# EAGLE design giraffe_clarity (EAGLE 9.2.1)
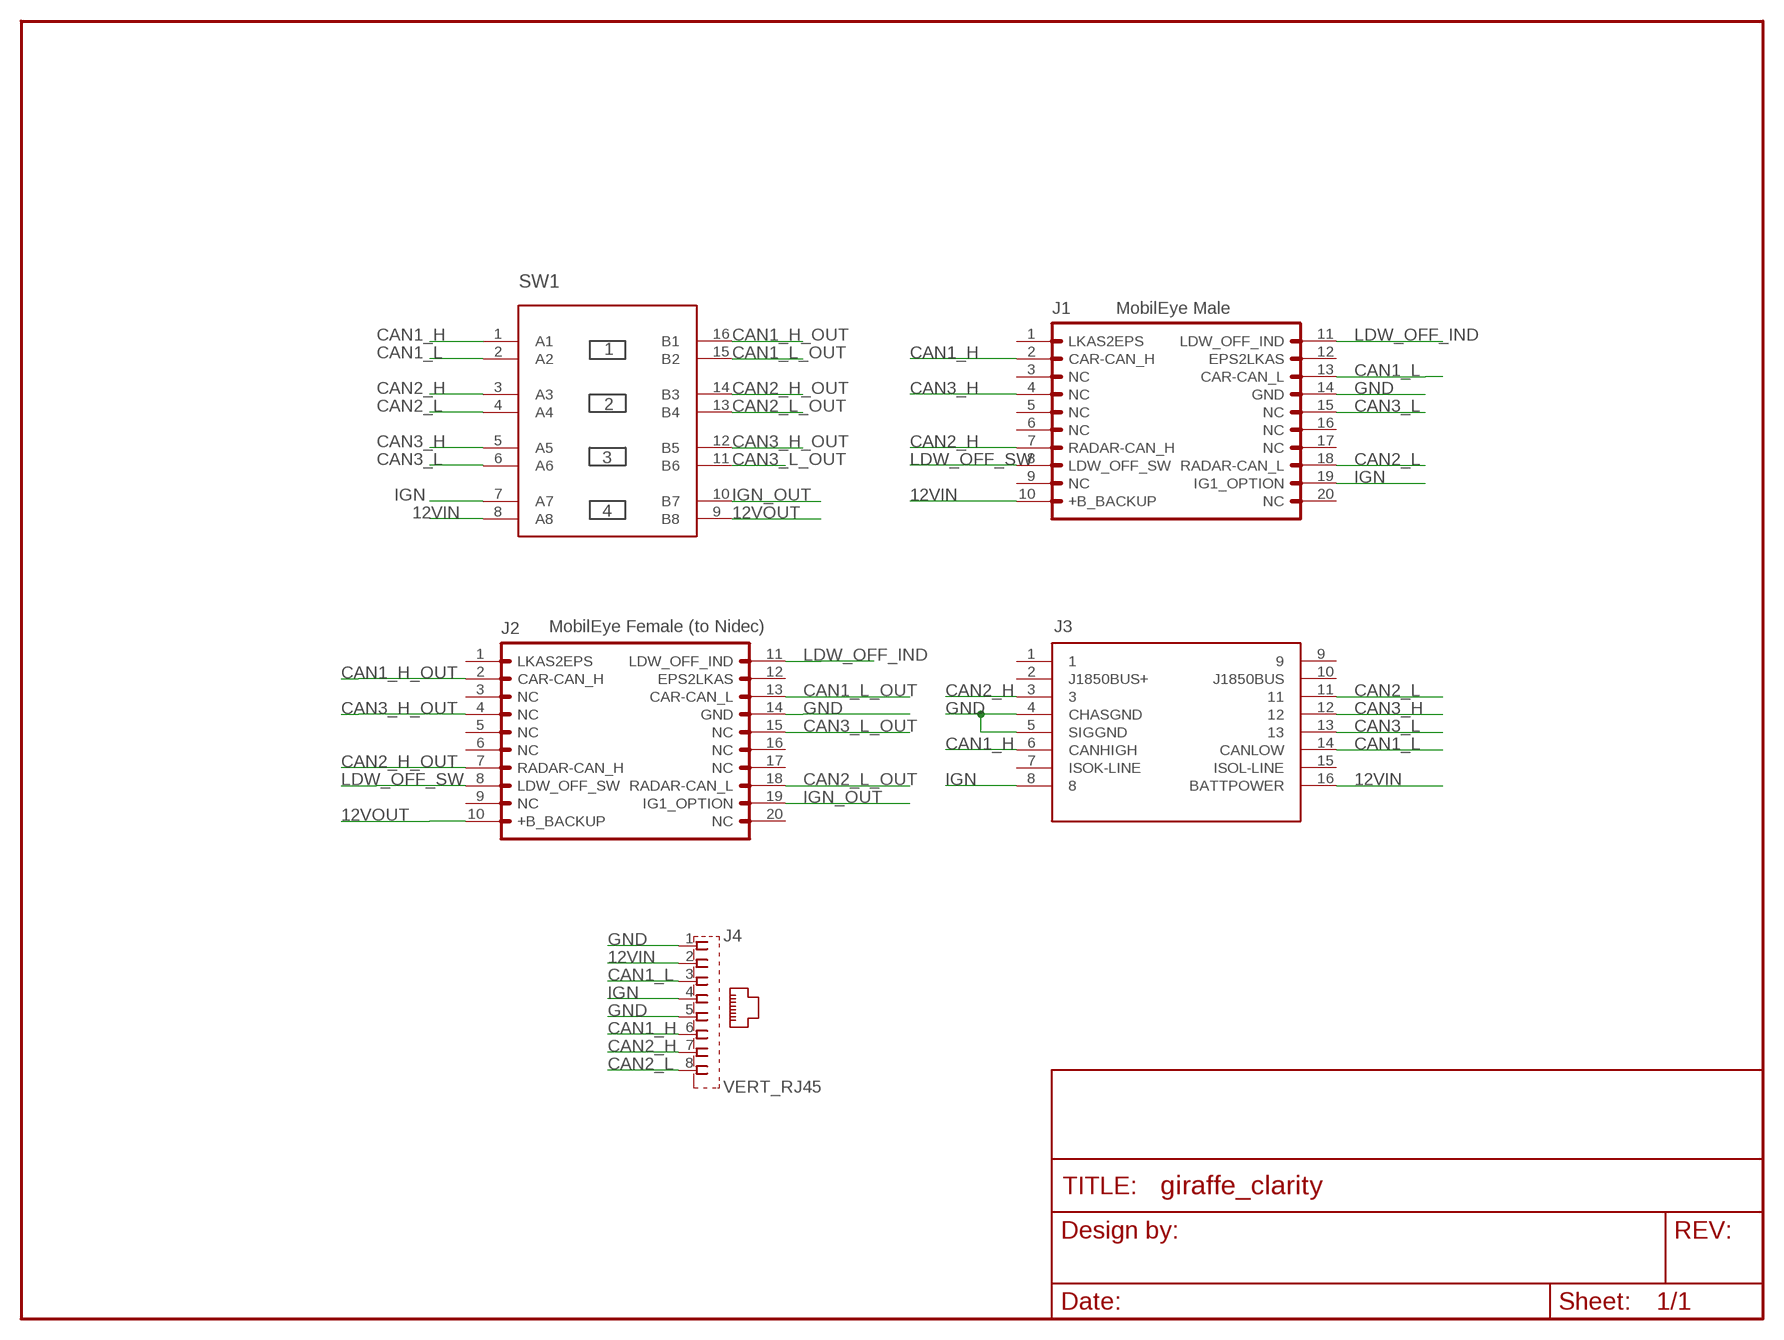
[diagram p0: schematic, sheet 1]

## Parts
FRAME1  FRAME-LETTERNO_PACKAGE  [DUMMY]
J1  MOBILEYERAMALE  [2X10(RA)]
J2  MOBILEYEFEMALE  [2X10(JAE_FEMALE)]
J3  OBDII-FEMALE-CUT  [OBDII-FEMALE-MIDCUT]
J4  VERT_RJ45  [GLX-S-88M]
SW1  4XDPSTSMT  [4-DPST]

## Nets
12VIN: J1.10(+B_BACKUP) J3.16(BATTPOWER) J4.2 SW1.8(A8)
12VOUT: J2.10(+B_BACKUP) SW1.9(B8)
CAN1_H: J1.2(CAR-CAN_H) J3.6(CANHIGH) J4.6 SW1.1(A1)
CAN1_H_OUT: J2.2(CAR-CAN_H) SW1.16(B1)
CAN1_L: J1.13(CAR-CAN_L) J3.14(CANLOW) J4.3 SW1.2(A2)
CAN1_L_OUT: J2.13(CAR-CAN_L) SW1.15(B2)
CAN2_H: J1.7(RADAR-CAN_H) J3.3 J4.7 SW1.3(A3)
CAN2_H_OUT: J2.7(RADAR-CAN_H) SW1.14(B3)
CAN2_L: J1.18(RADAR-CAN_L) J3.11 J4.8 SW1.4(A4)
CAN2_L_OUT: J2.18(RADAR-CAN_L) SW1.13(B4)
CAN3_H: J1.4(NC) J3.12 SW1.5(A5)
CAN3_H_OUT: J2.4(NC) SW1.12(B5)
CAN3_L: J1.15(NC) J3.13 SW1.6(A6)
CAN3_L_OUT: J2.15(NC) SW1.11(B6)
GND: J1.14(GND) J2.14(GND) J3.4(CHASGND) J3.5(SIGGND) J4.1 J4.5
IGN: J1.19(IG1_OPTION) J3.8 J4.4 SW1.7(A7)
IGN_OUT: J2.19(IG1_OPTION) SW1.10(B7)
LDW_OFF_IND: J1.11(LDW_OFF_IND) J2.11(LDW_OFF_IND)
LDW_OFF_SW: J1.8(LDW_OFF_SW) J2.8(LDW_OFF_SW)
Unconnected: J1.1(LKAS2EPS) J1.3(NC) J1.5(NC) J1.6(NC) J1.9(NC) J1.12(EPS2LKAS) J1.16(NC) J1.17(NC) J1.20(NC) J2.1(LKAS2EPS) J2.3(NC) J2.5(NC) J2.6(NC) J2.9(NC) J2.12(EPS2LKAS) J2.16(NC) J2.17(NC) J2.20(NC) J3.1 J3.2(J1850BUS+) J3.7(ISOK-LINE) J3.9 J3.10(J1850BUS) J3.15(ISOL-LINE)

## Notes on the sheet
- MobilEye Male
- MobilEye Female (to Nidec)

## Library data of the parts
FRAME1 = SparkFun-Aesthetics:FRAME-LETTER: Schematic Frame Standard 8.5x11 US Letter frame; DESIGNER: Nobody; VERSION: v01
J1 J2 = comma.ai:MOBILEYE: MobileEye connector for Acura ILX
J3 = comma.ai:OBDII-FEMALE
J4 = comma.ai:VERT_RJ45: Mod. Jack, Right Angle, 8 posiotion, 8 contatcs RJ45 Source: GLX-S-88M.pdf; OC_FARNELL: unknown; OC_NEWARK: unknown
SW1 = comma.ai:4XDPST

## Net classes
1 data: width 0.254 mm, clearance 0.254 mm

## Board
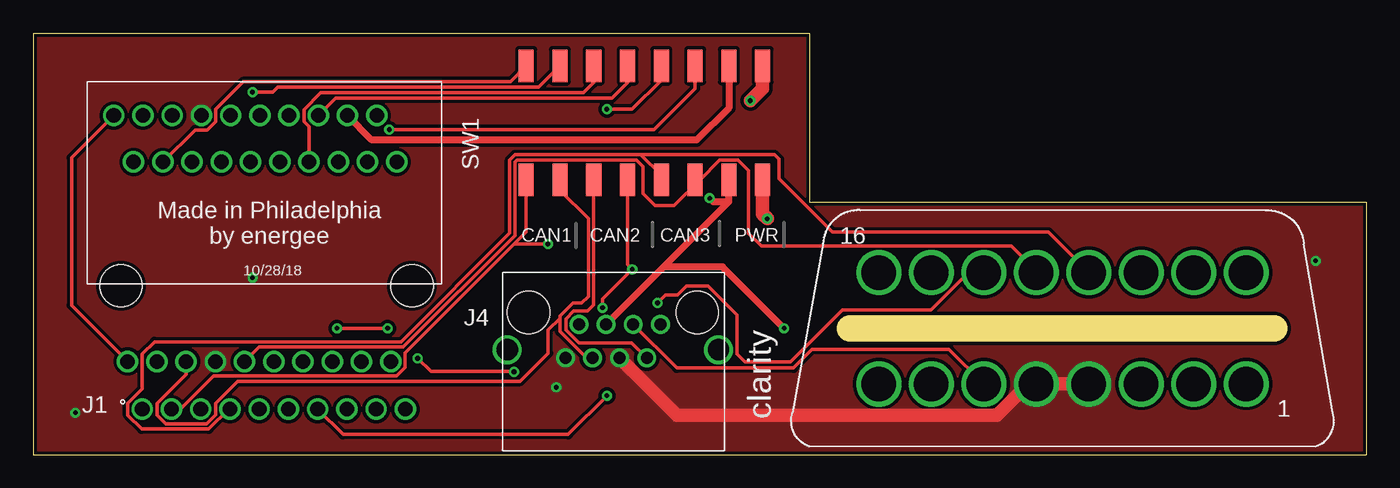
[diagram p1: board, top side]
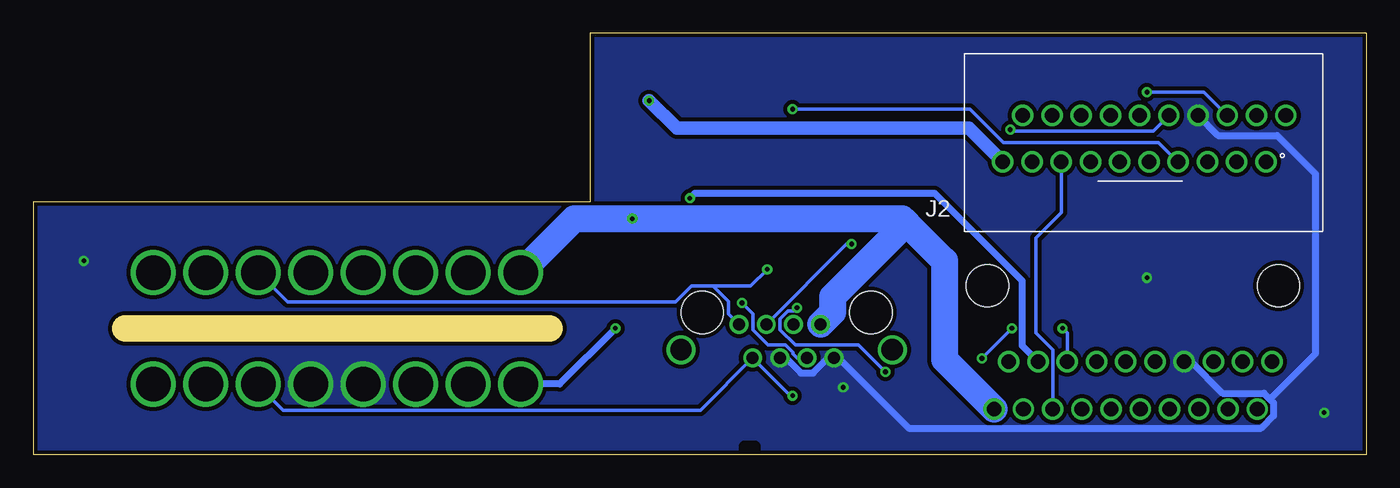
[diagram p2: board, bottom side, seen from below]

Size 100.33 x 31.75 mm. Coordinates in mm from the lower left corner, seen from the top.
Outline: 61.47,9.53 93.4,9.53
Outline: 0,31.75 58.42,31.75 58.42,19.05 100.33,19.05 100.33,0 0,0 0,31.75
Copper layers (1*16): Top 0.035mm / dielectric 1.5mm / Bottom 0.035mm
Design rules "default *": minimum track width 6mil, minimum drill 10mil, track to track 6mil, track to pad 6mil, pad to pad 6mil, via to via 6mil, smd to smd 6mil, copper to edge 10mil, drill to drill 10mil, minimum pad ring 10mil, minimum via ring 8mil, stop-mask expansion 4mil, vias tented up to drill 100mil, thermal gap 10mil
bRestrict: area 46,0.2 to 46.8,0.6

### Footprints (pad centres in the part's own frame; a part is rotated, then mirrored left to right if it is on the bottom)
2X10(RA) = drill 1.1 pad 1.422: 1 9.83,1.83; 2 7.63,1.83; 3 5.43,1.83; 4 3.23,1.83; 5 1.03,1.83; 6 -1.17,1.83; 7 -3.37,1.83; 8 -5.57,1.83; 9 -7.77,1.83; 10 -9.97,1.83; 11 10.93,-1.77; 12 8.73,-1.77; 13 6.53,-1.77; 14 4.33,-1.77; 15 2.13,-1.77; 16 -0.07,-1.77; 17 -2.27,-1.77; 18 -4.47,-1.77; 19 -6.67,-1.77; 20 -8.87,-1.77 | hole 3.2: -10.47,-7.47; 11.43,-7.47
2X10(JAE_FEMALE) = drill 1.1 pad 1.422: 1 -8.7,1.75; 2 -6.5,1.75; 3 -4.3,1.75; 4 -2.1,1.75; 5 0.1,1.75; 6 2.3,1.75; 7 4.5,1.75; 8 6.7,1.75; 9 8.9,1.75; 10 11.1,1.75; 11 -10.2,-1.75; 12 -8,-1.75; 13 -5.8,-1.75; 14 -3.6,-1.75; 15 -1.4,-1.75; 16 0.8,-1.75; 17 3,-1.75; 18 5.2,-1.75; 19 7.4,-1.75; 20 9.6,-1.75
OBDII-FEMALE-MIDCUT = drill 2.6 pad 3.4: 1 13.825,-4.2; 2 9.875,-4.2; 3 5.925,-4.2; 4 1.975,-4.2; 5 -1.975,-4.2; 6 -5.925,-4.2; 7 -9.875,-4.2; 8 -13.825,-4.2; 9 13.825,4.2; 10 9.875,4.2; 11 5.925,4.2; 12 1.975,4.2; 13 -1.975,4.2; 14 -5.925,4.2; 15 -9.875,4.2; 16 -13.825,4.2
GLX-S-88M = drill 0.9 pad 1.422: 1 -3.66,1.57; 2 -2.64,4.11; 3 -1.62,1.57; 4 -0.6,4.11; 5 0.42,1.57; 6 1.44,4.11; 7 2.46,1.57; 8 3.48,4.11 | drill 1.6 pad 2.184: S1 -8.04,2.2; S2 7.86,2.2 | hole 3.2: -6.44,5; 6.26,5
4-DPST = smd 1.13 x 2.44: 1 -8.89,-4.3; 2 -6.35,-4.3; 3 -3.81,-4.3; 4 -1.27,-4.3; 5 1.27,-4.3; 6 3.81,-4.3; 7 6.35,-4.3; 8 8.89,-4.3; 9 8.89,4.3; 10 6.35,4.3; 11 3.81,4.3; 12 1.27,4.3; 13 -1.27,4.3; 14 -3.81,4.3; 15 -6.35,4.3; 16 -8.89,4.3

### Placement (x,y rotation side)
FRAME1  -1.27,-12.7 0 top  (outside the outline)
J1  18.03,5.26 180 top
J2  16.26,23.8 180 bottom
J3  77.47,9.53 0 top
J4  43.72,5.71 0 top
SW1  46,24.99 0 top

### Tracks (layer width: path | path; a pad name or v marks a point on that pad's centre or on a via)
12VIN  (via drill 0.35)
  Top 1.016: v55.24,17.78 54.89,18.14 SW1.8
  Bottom 2.032: J3.16 59.59,17.78 v55.24,17.78 34.92,17.78 34.61,17.46 | J1.10 31.75,7.17 31.75,14.61 34.61,17.46 | J4.2 40.15,10.76 40.15,11.92 34.61,17.46
12VOUT  (via drill 0.35)
  Top 1.016: SW1.9 54.89,27.59 v53.98,26.67
  Bottom 1.016: J2.10 29.9,24.59 51.9,24.59 v53.98,26.67
CAN1_H  (via drill 0.35)
  Top 0.254: J3.6 68.93,7.94 58.62,7.94 57.23,6.54 48.44,6.54 J4.6 | SW1.1 37.11,16.79 36.2,15.88 | J1.2 11.07,3.43 13.59,5.94 27.35,5.94 27.99,6.58 27.99,7.67 35.88,15.56 36.2,15.88 | 36.2,15.88 v38.73,15.88
  Bottom 0.254: J4.6 39.11,15.88 v38.73,15.88
CAN1_H_OUT
  Top 0.254: SW1.16 35.91,28.09 15.8,28.09 13.74,26.03 13.74,25.1 13.11,24.47 12.17,24.47 J2.2
CAN1_L  (via drill 0.35)
  Top 0.254: J4.3 41.64,7.29 39.65,9.28 39.65,10.28 | J1.13 11.5,6.06 9.32,3.88 9.32,2.98 9.96,2.34 13.05,2.34 13.72,3.01 13.72,3.88 15.38,5.54 36.65,5.54 38.76,7.64 38.76,9.39 39.65,10.28 | 39.65,10.28 39.65,10.44 40.64,11.43 41.27,11.43 41.78,11.94 41.78,17.78 39.65,19.91 SW1.2 | J3.14 70.39,13.72 67.58,10.9 60.9,10.9 56.98,6.99 53.57,6.99 52.95,7.6 52.95,10.54 50.8,12.7 49.16,12.7 48.51,12.04 47.6,12.04 v46.99,11.43
  Bottom 0.254: J4.3 42.84,7.29 43.15,7.59 43.15,7.7 43.73,8.28 45.01,8.28 46.15,9.41 46.15,10.59 v46.99,11.43
CAN1_L_OUT  (via drill 0.35)
  Top 0.254: SW1.15 38.03,27.68 18.68,27.68 18.67,27.69 18.41,27.69 18.03,27.3 v16.51,27.3
  Bottom 0.254: v16.51,27.3 12.21,27.3 J2.13
CAN2_H  (via drill 0.35)
  Top 0.254: SW1.3 42.19,11.28 41.73,10.82 40.67,10.82 40.09,10.23 40.09,9.41 41.08,8.43 45.04,8.43 J4.7 | J1.7 23.31,1.52 40.26,1.52 v43.18,4.45
  Bottom 0.254: J3.3 83.39,5.21 81.53,3.35 50.12,3.35 J4.7 43.34,4.45 v43.18,4.45
CAN2_H_OUT
  Top 0.254: SW1.14 42.19,28.02 41.44,27.27 21.64,27.27 20.37,26 20.37,25.1 20.76,24.72 J2.7
CAN2_L  (via drill 0.35)
  Top 0.254: v26.67,9.53 v22.86,9.53 | v36.2,6.25 36.18,6.26 29.93,6.26 v28.93,7.26 | SW1.4 44.73,14.32 v45.09,13.97 42.85,11.73 v42.85,11.07
  Bottom 0.254: J3.11 81.19,11.52 51.98,11.52 50.8,12.7 49.16,12.7 | v22.86,9.53 22.5,9.17 J1.18 | v28.93,7.26 v26.67,9.53 | 49.16,12.7 48,11.54 48,10.62 J4.8 | v45.09,13.97 46.36,12.7 49.16,12.7 | v42.85,11.07 43.1,10.82 43.53,10.82 44.11,10.23 44.11,9.41 42.97,8.28 38.22,8.28 v36.2,6.25
CAN2_L_OUT
  Top 0.254: SW1.13 44.73,28.02 43.57,26.86 22.77,26.86 J2.18
CAN3_H
  Top 0.254: J3.12 76.41,16.76 60.17,16.76 56.13,20.8 56.13,22.27 55.8,22.6 45.72,22.6 | J1.4 14.71,3.43 13.22,1.94 8.16,1.94 7.12,2.98 7.12,3.88 8.21,4.97 8.21,7.6 9.12,8.52 27.69,8.52 35.86,16.69 35.86,22.2 36.26,22.6 45.72,22.6 | 45.72,22.6 47.27,21.05 SW1.5
CAN3_H_OUT  (via drill 0.35)
  Top 0.254: SW1.12 47.27,28.22 45.09,26.04 v43.18,26.04
  Bottom 0.254: v43.18,26.04 29.84,26.04 27.3,23.5 15.65,23.5 14.2,22.05 J2.4
CAN3_L
  Top 0.254: J3.13 75.5,13.84 73.64,15.7 54.8,15.7 53.83,16.67 53.83,21.39 53.03,22.19 51.67,22.19 50.17,20.69 50.16,20.69 | SW1.6 50.16,20.69 | J1.15 15.94,7.03 17.02,8.11 27.86,8.11 36.27,16.52 36.27,22.03 36.43,22.19 45.41,22.19 45.89,21.71 45.89,19.68 46.81,18.76 48.23,18.76 50.16,20.69
CAN3_L_OUT  (via drill 0.35)
  Top 0.254: 49.45,29.29 SW1.11 49.81,27.59 46.72,24.49 27.61,24.49 v26.8,24.49
  Bottom 0.254: v26.8,24.49 26.8,24.39 16.02,24.39 J2.15
GND  (via drill 0.35)
  Top 1.016: J4.5 48.46,2.96 72.52,2.96 74.88,5.33 J3.5 J3.4
  Bottom 0.508: J4.5 43.68,7.29 42.56,6.17 41.64,6.17 40.52,7.29 J4.1 39.71,7.29 34.43,2 7.92,2 6.99,2.93 6.99,3.93 7.25,4.18 | 7.25,4.18 7.7,4.64 10.83,4.64 13.22,7.03 J1.14 | 7.25,4.18 3.81,7.62 3.81,21.15 6.71,24.05 11.16,24.05 J2.14
  other vias: 3.17,3.17 16.51,13.34 39.37,5.08 96.52,14.61
  pour Top (isolate 0.254, no thermals): 0,31.75 0,0 100.33,0 100.33,19.05 58.42,19.05 58.42,31.75
  pour Bottom (isolate 0.305, no thermals): -0.05,31.8 58.42,31.8 58.42,19 100.3,19 100.3,0 -0.05,0
IGN  (via drill 0.35)
  Top 0.508: J4.4 47.45,14.15 | 47.45,14.15 52.35,19.05 | 52.35,19.05 SW1.7 | v50.91,19.33 51.18,19.05 52.35,19.05 | v56.52,9.53 51.89,14.15 47.45,14.15
  Bottom 0.508: v56.52,9.53 60.72,5.33 J3.8 | J1.19 25.89,8.21 25.89,13.09 32.48,19.68 50.55,19.68 v50.91,19.33
IGN_OUT
  Top 0.508: J2.19 23.66,25.53 25.48,23.7 49.94,23.7 52.35,26.12 SW1.10
LDW_OFF_IND
  Top 0.254: J2.11 2.88,22.38 2.88,11.25 J1.11
LDW_OFF_SW
  Bottom 0.254: J1.8 23.6,7.91 24.86,9.16 24.86,16.34 22.96,18.24 J2.8

### Text on the board
tPlace: Made in Philadelphia / by energee | CAN1 | CAN2 | CAN3 | PWR | 10/28/18 | clarity
Document: *compatible with freeTheC pins soldered on TOP